# EAGLE design arduino (EAGLE 7.4.0)
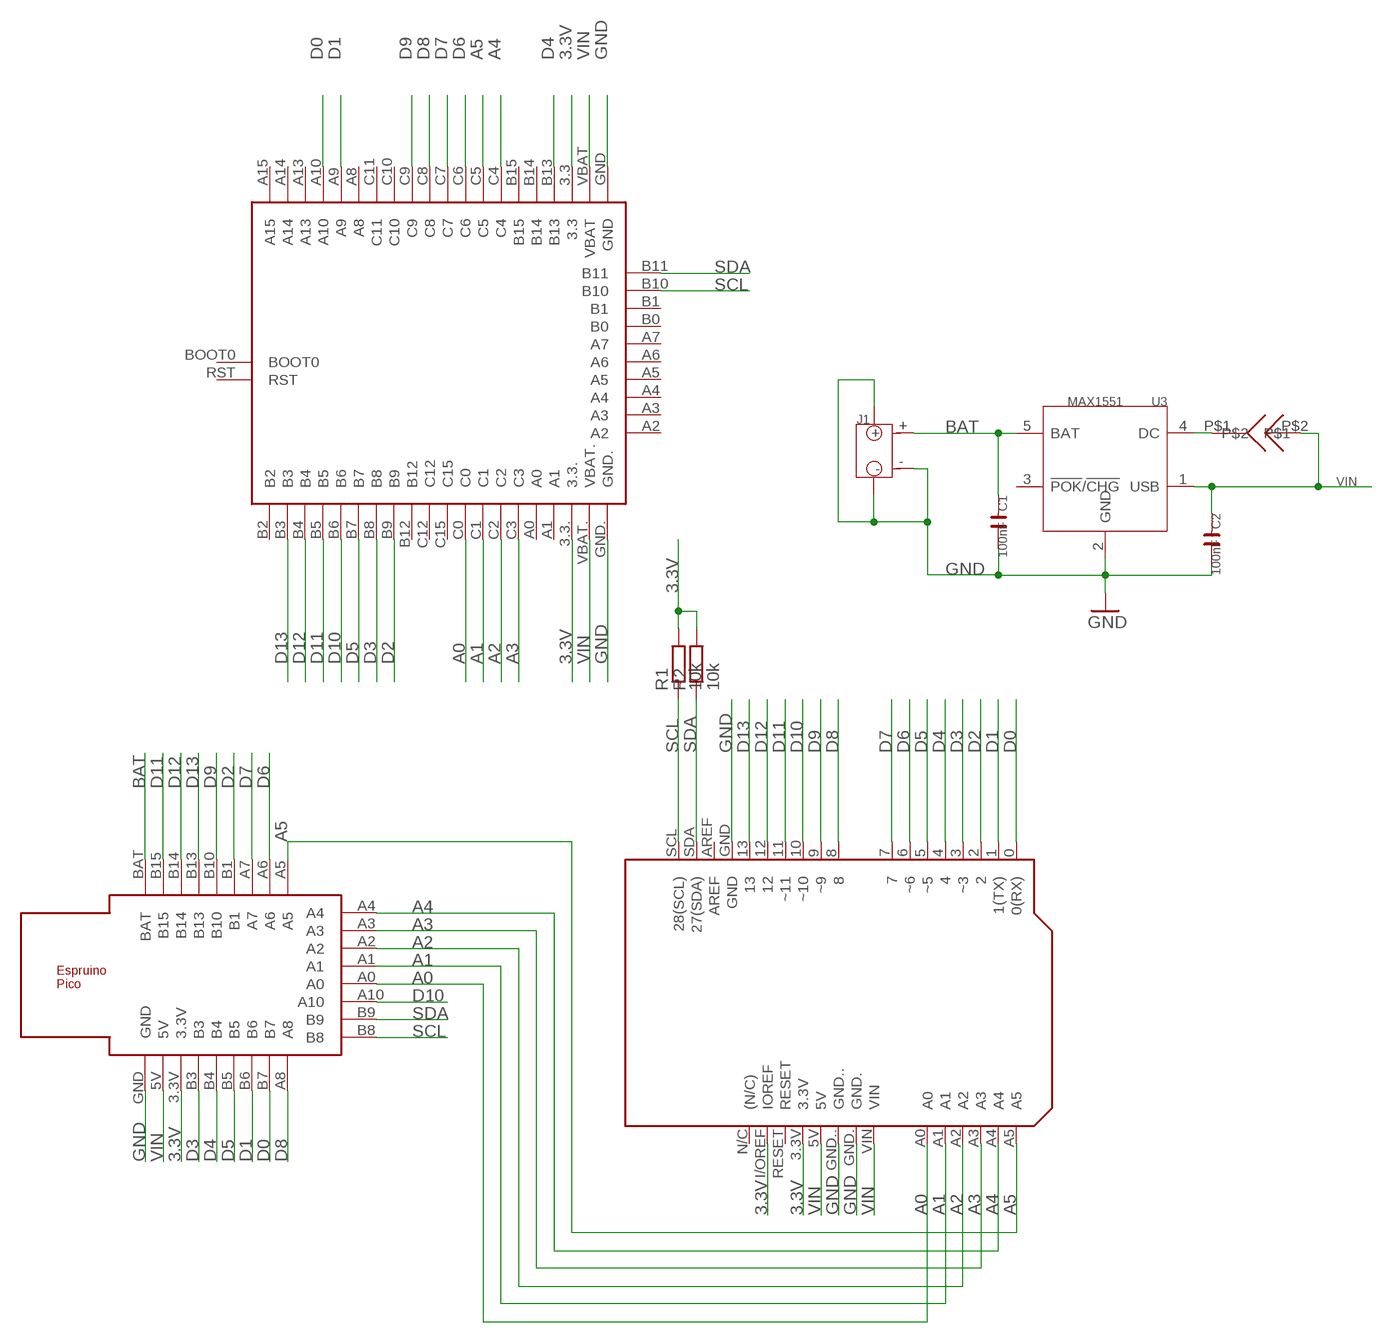
[diagram p0: schematic, sheet 1]

## Parts
C1  100nF  C-0603  [C0603]
C2  100nF  C-0603  [C0603]
J1  JST-2P-SMD-PW-3410050P1  [2P-SMD-2.0-90D]
R1  10k  R-EU_R0805  [R0805]
R2  10k  R-EU_R0805  [R0805]
U3  MAX1551  [SOT23-5]
U$1  ESPRUINO_PICO_SMD  [ESPRUINO_PICO_SMD]
U$2  ARDUINO  [ARDUINO]
U$3  ESPRUINO  [ESPRUINO]
U$4  SOLDERJUMPER  [SOLDERJUMPER]

## Nets
3.3V [power]: R1.2 R2.2 U$1.3.3V U$2.3.3V U$2.I/OREF(IOREF) U$3.3.3 U$3.3.3.
A0: U$1.A0 U$2.A0 U$3.C0
A1: U$1.A1 U$2.A1 U$3.C1
A2: U$1.A2 U$2.A2 U$3.C2
A3: U$1.A3 U$2.A3 U$3.C3
A4: U$1.A4 U$2.A4 U$3.C4
A5: U$1.A5 U$2.A5 U$3.C5
BAT: C1.1 J1.+ U3.5(BAT) U$1.BAT
D0: U$1.B7 U$2.0(0(RX)) U$3.A10
D1: U$1.B6 U$2.1(1(TX)) U$3.A9
D2: U$1.B1 U$2.2 U$3.B9
D3: U$1.B3 U$2.3(~3) U$3.B8
D4: U$1.B4 U$2.4 U$3.B13
D5: U$1.B5 U$2.5(~5) U$3.B7
D6: U$1.A6 U$2.6(~6) U$3.C6
D7: U$1.A7 U$2.7 U$3.C7
D8: U$1.A8 U$2.8 U$3.C8
D9: U$1.B10 U$2.9(~9) U$3.C9
D10: U$1.A10 U$2.10(~10) U$3.B6
D11: U$1.B15 U$2.11(~11) U$3.B5
D12: U$1.B14 U$2.12 U$3.B4
D13: U$1.B13 U$2.13 U$3.B3
GND [power]: C1.2 C2.2 J1.3 J1.4 J1.- U3.2(GND) U$1.GND U$2.GND U$2.GND. U$2.GND.. U$3.GND U$3.GND.
N$2: U3.4(DC) U$4.P$1
SCL: R1.1 U$1.B8 U$2.SCL(28(SCL)) U$3.B10
SDA: R2.1 U$1.B9 U$2.SDA(27(SDA)) U$3.B11
VIN [power]: C2.1 U3.1(USB) U$1.5V U$2.5V U$2.VIN U$3.VBAT U$3.VBAT. U$4.P$2
Unconnected: U3.3(!POK!/!CHG!) U$2.AREF U$2.N/C((N/C)) U$2.RESET U$3.A0 U$3.A1 U$3.A2 U$3.A3 U$3.A4 U$3.A5 U$3.A6 U$3.A7 U$3.A8 U$3.A13 U$3.A14 U$3.A15 U$3.B0 U$3.B1 U$3.B2 U$3.B12 U$3.B14 U$3.B15 U$3.BOOT0 U$3.C10 U$3.C11 U$3.C12 U$3.C15 U$3.RST

## Library data of the parts
C1 C2 = OPL5:C*
J1 = OPL Eagle Library:JST-2P-SMD-PW
R1 R2 = rcl:R-EU_: RESISTOR, European symbol
U3 = template:MAX1551: SOT23 Dual-Input USB/AC Adapter 1-Cell Li+ Battery Chargers
U$1 = espruino_pico:ESPRUINO_PICO_SMD
U$2 = arduino:ARDUINO
U$3 = espruino_pico:ESPRUINO
U$4 = solder_jumper:SOLDERJUMPER

## Net classes
0 default: width 0.305 mm
1 power: width 0.406 mm

## Board
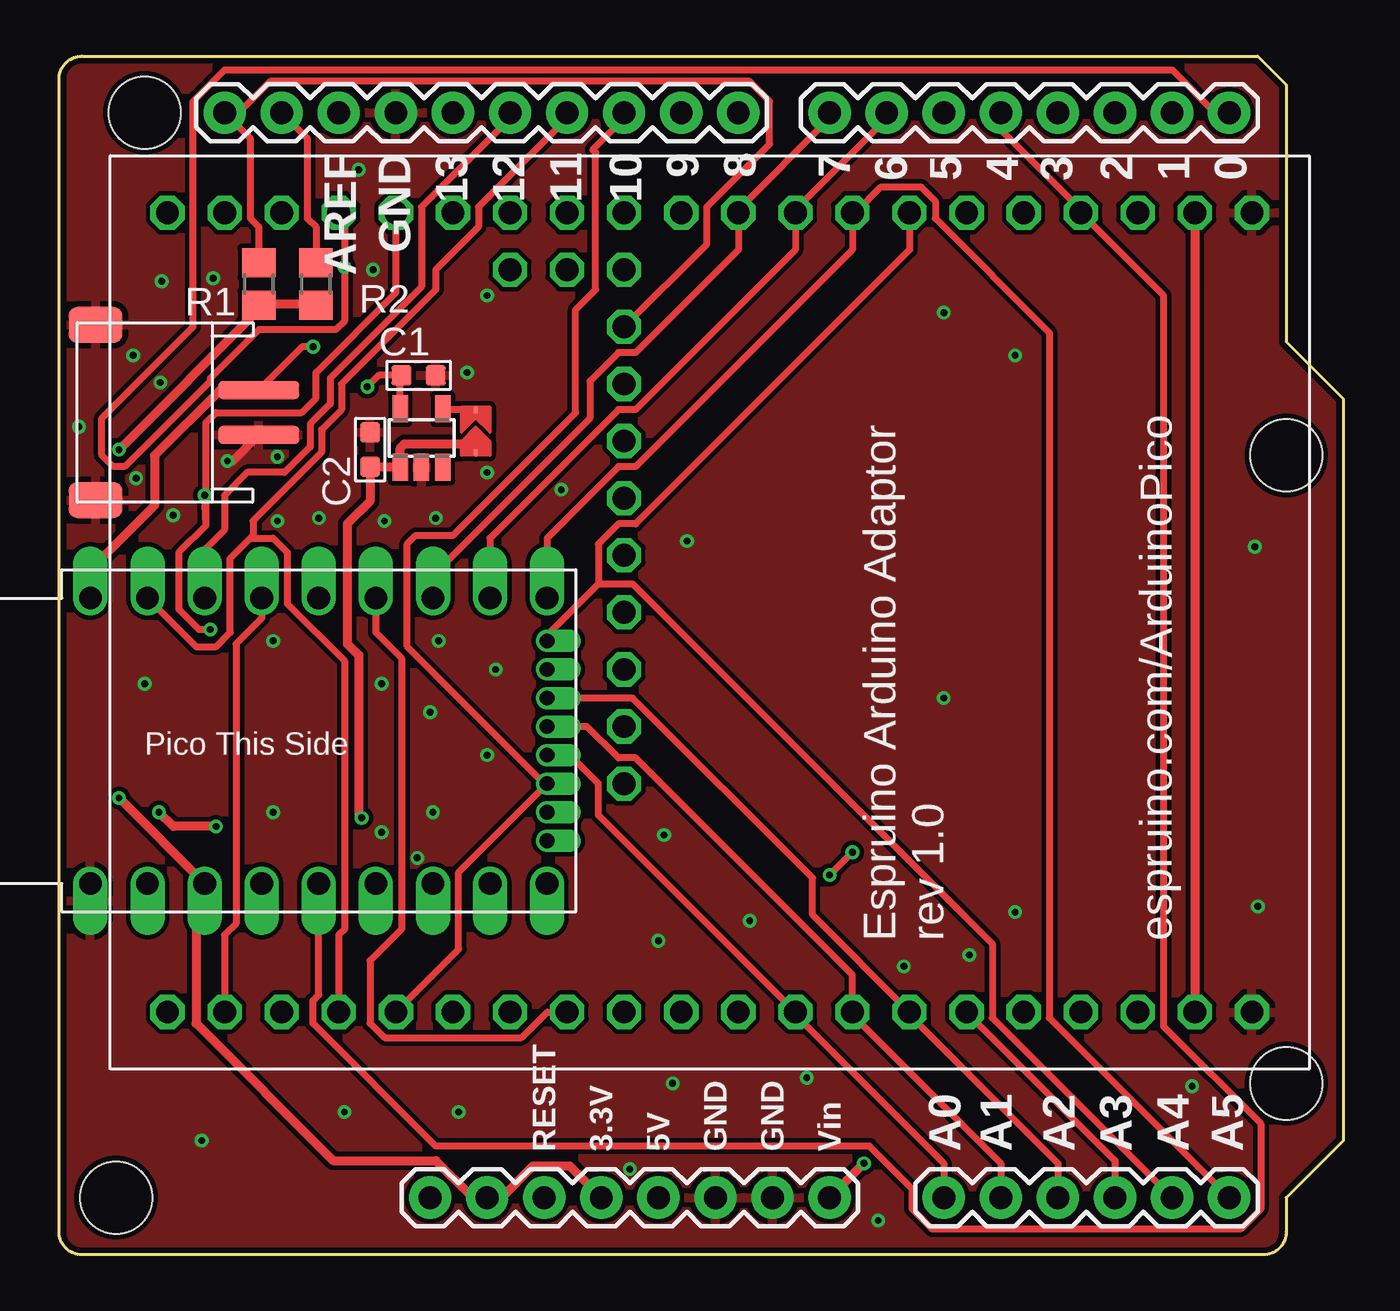
[diagram p1: board, top side]
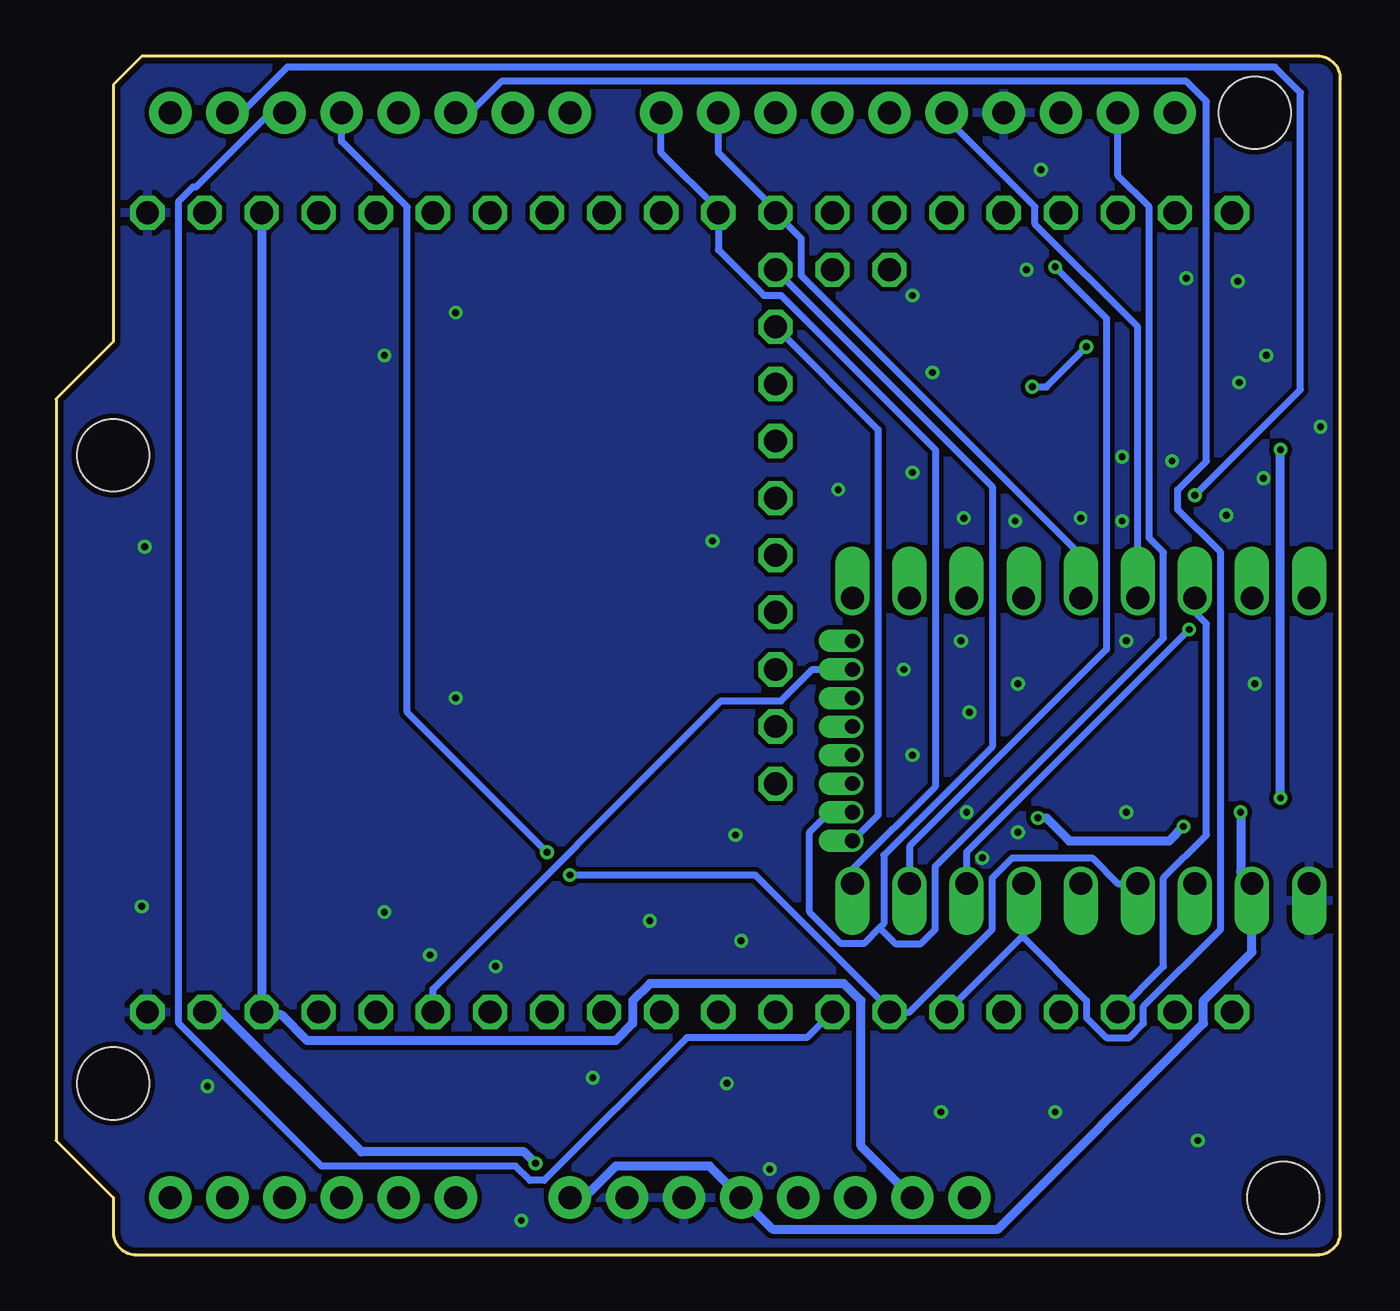
[diagram p2: board, bottom side, seen from below]

Size 57.15 x 53.31 mm. Coordinates in mm from the lower left corner, seen from the top.
Copper layers (1*16): Top 0.035mm / dielectric 1.5mm / Bottom 0.035mm
Design rules "dirt_cheap_dirty_boards.v1 *": minimum track width 5mil, minimum drill 12mil, track to track 8mil, track to pad 8mil, pad to pad 5mil, via to via 8mil, smd to smd 0mil, copper to edge 10mil, drill to drill 10mil, minimum pad ring 7mil, minimum via ring 6mil, stop-mask expansion 2mil, vias tented up to drill 25mil, thermal gap 10mil

### Footprints (pad centres in the part's own frame; a part is rotated, then mirrored left to right if it is on the bottom)
C0603 = smd 0.889 x 0.889: 1 -0.762,0; 2 0.762,0
2P-SMD-2.0-90D = smd 1.6 x 2.4: 3 3.9,-2.181; 4 -3.9,-2.181 | smd 0.8 x 3.6: + -1,5.08; - 1,5.08
R0805 = smd 1.3 x 1.5: 1 -0.95,0; 2 0.95,0
SOT23-5 = smd 0.69 x 1.2: 1 -0.95,-1.3; 2 0,-1.3; 3 0.95,-1.3; 4 0.95,1.3; 5 -0.95,1.3
ESPRUINO_PICO_SMD = drill 1.016 offset: 3.3V -8.89,-6.35; 5V -11.43,-6.35; A5 6.35,6.35; A6 3.81,6.35; A7 1.27,6.35; A8 6.35,-6.35; B1 -1.27,6.35; B3 -6.35,-6.35; B4 -3.81,-6.35; B5 -1.27,-6.35; B6 1.27,-6.35; B7 3.81,-6.35; B10 -3.81,6.35; B13 -6.35,6.35; B14 -8.89,6.35; B15 -11.43,6.35; BAT -13.97,6.35; GND -13.97,-6.35 | drill 0.65 pad 0.965 offset: A0 6.35,-0.635; A1 6.35,0.635; A2 6.35,1.905; A3 6.35,3.175; A4 6.35,4.445; A10 6.35,-1.905; B8 6.35,-4.445; B9 6.35,-3.175
ARDUINO = drill 1.016 pad 1.88: 0 27.94,24.13; 1 25.4,24.13; 2 22.86,24.13; 3 20.32,24.13; 3.3V 0,-24.13; 4 17.78,24.13; 5 15.24,24.13; 5V 2.54,-24.13; 6 12.7,24.13; 7 10.16,24.13; 8 6.096,24.13; 9 3.556,24.13; 10 1.016,24.13; 11 -1.524,24.13; 12 -4.064,24.13; 13 -6.604,24.13; A0 15.24,-24.13; A1 17.78,-24.13; A2 20.32,-24.13; A3 22.86,-24.13; A4 25.4,-24.13; A5 27.94,-24.13; AREF -11.684,24.13; GND -9.144,24.13; GND. 7.62,-24.13; GND.. 5.08,-24.13; I/OREF -5.08,-24.13; N/C -7.62,-24.13; RESET -2.54,-24.13; SCL -16.764,24.13; SDA -14.224,24.13; VIN 10.16,-24.13 | hole 3.2: 30.48,-19.05; 30.48,8.89; -20.32,24.13; -21.59,-24.13
ESPRUINO = drill 1.016 octagon: 3.3 19.05,16.51; 3.3. 19.05,-19.05; A0 13.97,-19.05; A1 16.51,-19.05; A2 -3.81,-8.89; A3 -3.81,-6.35; A4 -3.81,-3.81; A5 -3.81,-1.27; A6 -3.81,1.27; A7 -3.81,3.81; A8 -11.43,16.51; A9 -13.97,16.51; A10 -16.51,16.51; A13 -19.05,16.51; A14 -21.59,16.51; A15 -24.13,16.51; B0 -3.81,6.35; B1 -3.81,8.89; B2 -24.13,-19.05; B3 -21.59,-19.05; B4 -19.05,-19.05; B5 -16.51,-19.05; B6 -13.97,-19.05; B7 -11.43,-19.05; B8 -8.89,-19.05; B9 -6.35,-19.05; B10 -3.81,11.43; B11 -3.81,13.97; B12 -3.81,-19.05; B13 16.51,16.51; B14 13.97,16.51; B15 11.43,16.51; BOOT0 -6.35,13.97; C0 3.81,-19.05; C1 6.35,-19.05; C2 8.89,-19.05; C3 11.43,-19.05; C4 8.89,16.51; C5 6.35,16.51; C6 3.81,16.51; C7 1.27,16.51; C8 -1.27,16.51; C9 -3.81,16.51; C10 -6.35,16.51; C11 -8.89,16.51; C12 -1.27,-19.05; C15 1.27,-19.05; GND 24.13,16.51; GND. 24.13,-19.05; RST -8.89,13.97; VBAT 21.59,16.51; VBAT. 21.59,-19.05
SOLDERJUMPER = smd 0.305 x 0.152: P$1 0.762,0; P$2 -1.143,0

### Placement (x,y rotation side)
C1  16,39.12 0 top
C2  13.84,35.81 90 top
J1  3.81,37.47 270 top
R1  8.89,43.18 270 top
R2  11.43,43.18 270 top
U3  16.13,36.32 0 top
U$1  15.37,22.86 0 top
U$2  24.13,26.67 0 top
U$3  28.96,29.84 0 top
U$4  18.54,36.83 90 top

### Tracks (layer width: path | path; a pad name or v marks a point on that pad's centre or on a via)
3.3V  (via drill 0.3)
  Top 0.406: U$2.3.3V 22.73,3.94 21.08,3.94 19.68,2.54 U$2.I/OREF 18.92,2.67 18.29,2.67 16.76,4.19 12.19,4.19 6.1,10.29 6.1,16.13 U$1.3.3V v2.67,20.32 | R2.2 11.43,42.29 8.89,42.29 R1.2 8.89,42.04 v2.67,35.81
  Bottom 0.406: U$3.3.3 U$3.3.3. 47.88,10.67 47.12,10.67 45.97,9.53 32.26,9.53 31.5,10.29 31.5,11.3 30.73,12.06 22.1,12.06 21.34,11.3 21.34,4.83 U$2.I/OREF | v2.67,20.32 v2.67,35.81
A0
  Top 0.305: U$1.A0 22.73,22.23 24,20.95 24,19.56 U$3.C0 32.77,10.67 39.37,4.06 U$2.A0
A1
  Top 0.305: U$1.A1 23.5,23.5 24.89,22.1 25.65,22.1 35.31,12.45 U$3.C1 35.31,10.67 41.91,4.06 U$2.A1
A2
  Top 0.305: U$1.A2 25.53,24.77 33.53,16.76 33.53,15.11 U$3.C2 37.85,10.67 44.45,4.06 U$2.A2
A3
  Top 0.305: U$2.A3 46.99,4.19 U$3.C3
  Bottom 0.305: U$1.A3 23.5,26.04 24.89,24.64 27.56,24.64 40.39,11.81 U$3.C3
A4
  Top 0.305: U$1.A4 21.72,27.56 24,29.84 | 24,29.84 24,31.62 24.89,32.51 25.65,32.51 37.85,44.7 U$3.C4 | U$2.A4 41.53,10.54 41.53,13.84 25.53,29.84 24,29.84
A5
  Top 0.305: U$1.A5 21.72,31.88 24.89,35.05 25.65,35.05 35.31,44.7 U$3.C5 35.43,46.35 36.58,47.5 38.35,47.5 38.99,46.86 38.99,46.1 44.07,41.02 44.07,10.54 U$2.A5
BAT  (via drill 0.3)
  Top 0.305: U3.5 15.18,39.05 C1.1 14.22,39.12 v13.72,38.61 | v11.3,40.39 10.81,40.39 J1.+
  Top 0.406: J1.+ 7.16,38.47 4.25,35.56 4.25,33.34 1.4,30.48 U$1.BAT
  Bottom 0.305: v13.72,38.61 13.08,38.61 v11.3,40.39
D0  (via drill 0.3)
  Top 0.305: U$3.A10 12.7,46.1 v12.7,43.94 12.7,41.53 12.32,41.15 8.89,41.15 6.73,38.99 6.73,38.86 2.92,35.05 2.41,35.05 1.91,35.56 1.91,37.21 5.97,41.27 5.97,51.31 7.37,52.7 49.53,52.7 51.44,50.8 U$2.0
  Bottom 0.305: U$1.B7 19.18,18.16 10.41,26.92 10.41,41.66 v12.7,43.94
D1  (via drill 0.3)
  Top 0.305: v6.73,27.81 6.22,27.81 5.33,28.7 5.33,31.24 6.54,32.45 | U$3.A9 14.99,42.8 11.43,39.24 11.43,38.1 10.79,37.47 6.99,37.47 6.54,37.02 6.54,32.45 | 6.54,32.45 v6.48,33.78
  Bottom 0.305: U$1.B6 16.64,17.91 v6.73,27.81 | U$2.1 48.9,50.8 46.86,52.83 2.92,52.83 1.78,51.69 1.78,38.48 v6.48,33.78
D2
  Top 0.305: U$3.B9 21.72,10.79 20.57,9.65 14.48,9.65 13.84,10.29 13.84,13.08 15.24,14.48 15.24,26.54 14.1,27.69 U$1.B1
  Bottom 0.305: U$2.2 47.62,50.8 50.93,47.5 51.05,47.5 51.69,46.86 51.69,10.29 45.34,3.94 36.7,3.94 36.07,3.3 35.43,3.3 29.08,9.65 23.75,9.65 U$3.B9
D3  (via drill 0.3)
  Top 0.305: v34.29,16.89 v35.31,17.91
  Bottom 0.305: U$1.B3 9.91,16.51 11.05,17.65 14.61,17.65 15.49,16.76 15.49,14.48 19.18,10.79 U$3.B8 20.07,10.92 26.04,16.89 v34.29,16.89 | U$2.3 44.45,49.53 41.53,46.61 41.53,24.13 v35.31,17.91
D4
  Top 0.305: U$1.B4 11.56,11.56 11.3,11.3 11.3,10.29 16.76,4.83 36.07,4.83 37.97,2.92 37.97,2.03 38.86,1.14 52.58,1.14 53.47,2.03 53.47,5.84 49.15,10.16 49.15,42.67 U$3.B13 45.47,46.48 41.91,50.04 U$2.4
D5
  Bottom 0.305: 14.1,14.22 U$1.B5 | U$3.B7 14.1,14.22 | U$2.5 38.73,50.8 37.34,52.2 6.86,52.2 5.97,51.31 5.97,35.31 7.24,34.04 7.24,33.15 5.33,31.24 5.33,14.48 8.76,11.05 8.76,10.29 9.4,9.65 10.41,9.65 11.3,10.54 11.3,11.3 14.1,14.1 14.1,14.22
D6
  Top 0.305: U$1.A6 19.18,31.88 24.89,37.59 25.65,37.59 32.77,44.7 U$3.C6 32.77,46.48 36.83,50.55 U$2.6
D7
  Top 0.305: U$2.7 34.29,50.55 30.23,46.48 U$3.C7 30.23,44.7 25.65,40.13 24.89,40.13 23.62,38.86 23.62,37.21 16.64,30.23 U$1.A7
D8
  Bottom 0.305: U$1.A8 21.72,17.14 18.03,20.83 18.03,35.81 24.89,42.67 25.65,42.67 27.69,44.7 U$3.C8 27.69,46.48 30.23,49.02 U$2.8
D9
  Bottom 0.305: U$1.B10 11.56,31.11 24,43.56 24,45.21 U$3.C9 25.15,46.48 27.69,49.02 U$2.9
D10
  Top 0.305: U$3.B6 17.78,13.59 17.78,17.02 U$1.A10 21.59,20.95 15.49,27.05 15.49,31.62 15.88,32 17.53,32 22.99,37.47 22.99,42.04 23.88,42.93 23.88,49.02 23.75,49.15 25.15,50.55 U$2.10
D11
  Top 0.305: U$3.B5 12.45,14.22 12.7,14.48 12.7,26.42 10.16,28.96 10.16,31.24 9.53,31.88 8.51,31.88 | 8.51,31.88 7.62,30.99 7.62,27.69 6.99,27.05 6.1,27.05 U$1.B15 | U$2.11 22.61,50.55 18.67,46.61 18.67,45.72 16.76,43.81 16.76,42.93 12.57,38.73 12.57,37.59 11.68,36.7 11.68,35.69 8.64,32.64 8.64,32 8.51,31.88
D12
  Top 0.305: U$2.12 20.07,50.55 16.13,46.61 16.13,43.05 12.06,38.99 12.06,37.85 11.18,36.96 11.18,35.94 10.03,34.8 8.38,34.8 7.37,33.78 7.37,32.26 6.48,31.37 U$1.B14
  Bottom 0.305: U$1.B14 6.48,28.57 5.97,28.07 5.97,18.67 7.87,16.76 7.87,12.83 U$3.B4
D13
  Top 0.305: U$3.B3 7.37,14.22 7.87,14.73 7.87,27.18 9.02,28.32 U$1.B13
  Bottom 0.305: U$2.13 17.53,50.55 13.59,46.61 13.59,45.85 9.02,41.27 U$1.B13
GND  (via drill 0.3)
  Top 0.406: v7.49,35.31 7.73,35.31 J1.-
  other vias: 9.53,19.68 3.81,25.4 6.35,5.08 12.7,6.35 17.78,6.35 27.3,7.62 26.67,13.97 14.35,25.4 14.35,18.8 14.48,32.64 11.56,32.77 5.08,32.89 0.89,36.83 4.57,43.31 6.86,43.43 13.34,48.26 19.05,42.67 16.76,32.77 16.89,27.3 18.16,39.24 19.43,26.04 22.35,34.04 30.73,14.86 37.59,12.83 40.51,13.34 53.34,15.49 53.21,31.5 50.42,7.49 3.3,40.01 3.43,34.54 9.53,27.3 16.64,19.68 16.51,24.13 19.05,22.23 27.94,31.75 39.37,41.91 42.55,40.01 42.55,15.24 39.37,24.77 19.05,34.8 26.92,18.67 33.27,7.87 15.94,17.65 9.72,35.5 9.72,32.64 13.97,43.81 36.45,1.52 25.4,3.81 4.51,38.8
  pour Bottom: 0,53.34 57.15,53.34 57.15,0 0,0
  pour Top: 0,53.34 57.15,53.34 57.15,0 0,0
N$2
  Top 0.305: U$4.P$1 17.11,37.59 U3.4
SCL
  Top 0.305: R1.1 8.89,45.72 8.51,46.1 8.51,49.66 U$2.SCL 7.75,50.55 9.4,52.2 30.73,52.2 31.62,51.31 31.62,49.4 28.83,46.61 28.83,44.96 U$3.B10
  Bottom 0.305: U$1.B8 20.57,19.56 20.57,36.7 U$3.B10
SDA
  Top 0.305: R2.1 11.43,45.72 11.05,46.1 11.05,49.66 U$2.SDA
  Bottom 0.305: U$1.B9 22.73,19.68 23.62,18.8 23.62,15.24 22.23,13.84 21.21,13.84 20.51,14.54 | 20.51,14.54 20.32,14.73 20.32,17.78 15.49,22.61 15.49,34.16 U$3.B11 | U$2.SDA 9.91,48.01 8.51,46.61 8.51,31.88 7.87,31.24 7.87,27.43 18.03,17.27 18.03,14.48 18.67,13.84 19.81,13.84 20.51,14.54
VIN  (via drill 0.3)
  Top 0.406: U$3.VBAT U$3.VBAT. | U$2.VIN v35.81,4.06 | U$4.P$2 18.16,36.07 15.37,36.07 15.18,35.88 U3.1 15.15,35.05 C2.1 13.84,33.53 12.83,32.51 12.83,27.18 13.34,26.67 13.34,19.56 v13.46,19.43 | v6.99,19.05 5.08,19.05 v4.45,19.68
  Bottom 0.406: U$2.VIN 33.66,2.54 32.26,3.94 28.07,3.94 U$2.5V 25.27,1.14 15.24,1.14 6.1,10.29 6.1,11.3 3.94,13.46 U$1.5V 4.45,17.02 v4.45,19.68 | U$3.VBAT. 49.78,10.79 43.56,4.57 36.32,4.57 v35.81,4.06 | v13.46,19.43 13.08,19.43 12.06,18.41 7.62,18.41 v6.99,19.05

### Text on the board
tNames: Pico This Side | Espruino Arduino Adaptor / rev 1.0 | espruino.com/ArduinoPico